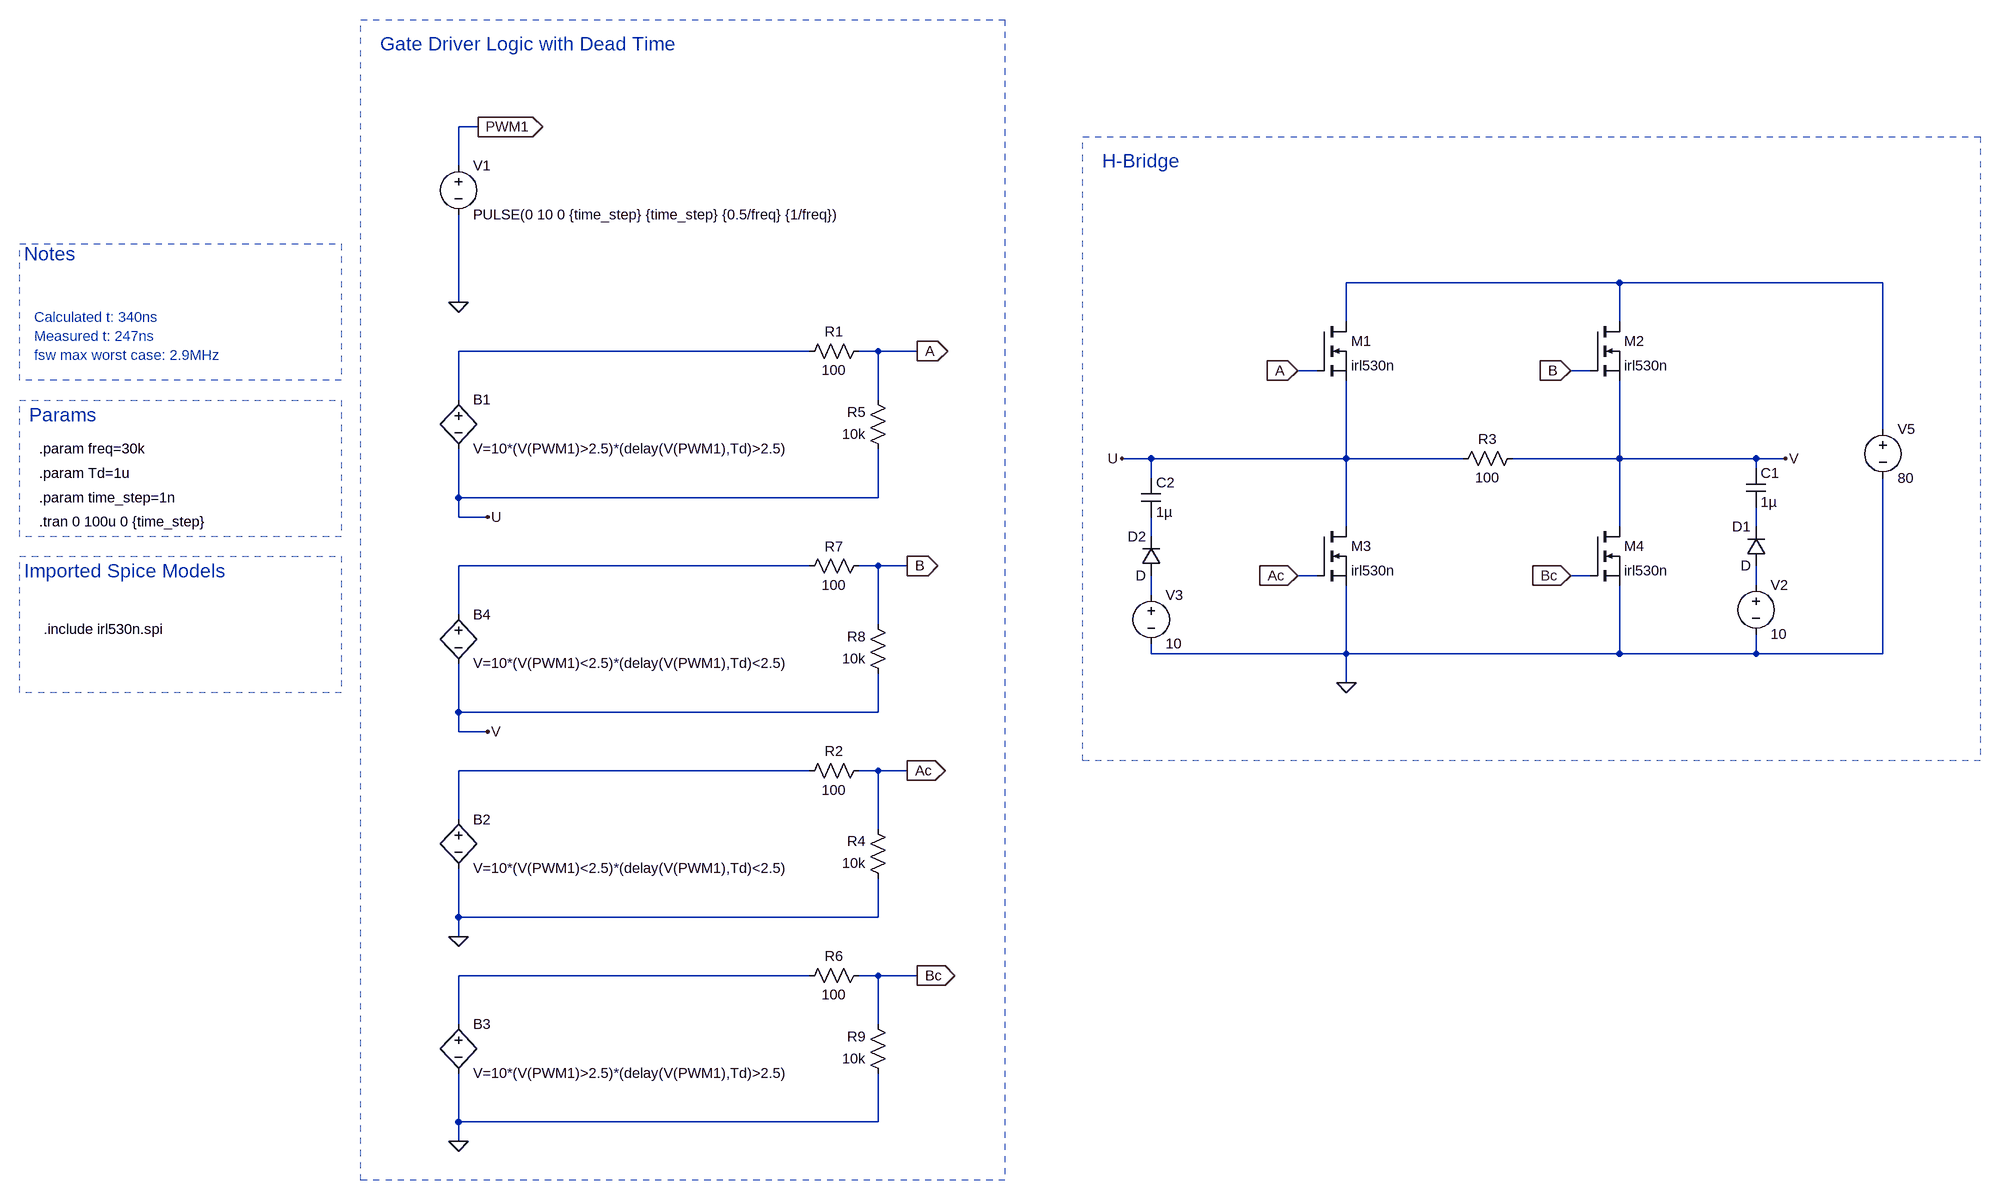
[diagram p0: schematic H_Bridge.asc]
H_Bridge.asc, the LTspice schematic file:
Version 4.1
SHEET 1 4488 1076
WIRE 448 -736 416 -736
WIRE 416 -672 416 -736
WIRE 2320 -480 1872 -480
WIRE 2752 -480 2320 -480
WIRE 416 -448 416 -592
WIRE 1872 -416 1872 -480
WIRE 2320 -416 2320 -480
WIRE 992 -368 416 -368
WIRE 1104 -368 1072 -368
WIRE 1168 -368 1104 -368
WIRE 1824 -336 1792 -336
WIRE 2272 -336 2240 -336
WIRE 416 -288 416 -368
WIRE 1104 -288 1104 -368
WIRE 2752 -240 2752 -480
WIRE 1552 -192 1504 -192
WIRE 1872 -192 1872 -320
WIRE 1872 -192 1552 -192
WIRE 2064 -192 1872 -192
WIRE 2320 -192 2320 -320
WIRE 2320 -192 2144 -192
WIRE 2544 -192 2320 -192
WIRE 2592 -192 2544 -192
WIRE 2544 -176 2544 -192
WIRE 1552 -160 1552 -192
WIRE 416 -128 416 -208
WIRE 1104 -128 1104 -208
WIRE 1104 -128 416 -128
WIRE 416 -96 416 -128
WIRE 464 -96 416 -96
WIRE 1872 -80 1872 -192
WIRE 2320 -80 2320 -192
WIRE 2544 -80 2544 -112
WIRE 1552 -64 1552 -96
WIRE 992 -16 416 -16
WIRE 1104 -16 1072 -16
WIRE 1152 -16 1104 -16
WIRE 1824 0 1792 0
WIRE 2272 0 2240 0
WIRE 2544 16 2544 -16
WIRE 1552 32 1552 0
WIRE 416 64 416 -16
WIRE 1104 80 1104 -16
WIRE 1552 128 1552 112
WIRE 1872 128 1872 16
WIRE 1872 128 1552 128
WIRE 2320 128 2320 16
WIRE 2320 128 1872 128
WIRE 2544 128 2544 96
WIRE 2544 128 2320 128
WIRE 2752 128 2752 -160
WIRE 2752 128 2544 128
WIRE 1872 176 1872 128
WIRE 416 224 416 144
WIRE 1104 224 1104 160
WIRE 1104 224 416 224
WIRE 416 256 416 224
WIRE 464 256 416 256
WIRE 992 320 416 320
WIRE 1104 320 1072 320
WIRE 1152 320 1104 320
WIRE 416 400 416 320
WIRE 1104 416 1104 320
WIRE 416 560 416 480
WIRE 1104 560 1104 496
WIRE 1104 560 416 560
WIRE 416 592 416 560
WIRE 992 656 416 656
WIRE 1104 656 1072 656
WIRE 1168 656 1104 656
WIRE 416 736 416 656
WIRE 1104 736 1104 656
WIRE 416 896 416 816
WIRE 1104 896 1104 816
WIRE 1104 896 416 896
WIRE 416 928 416 896
FLAG 1792 -336 A
IOPIN 1792 -336 In
FLAG 1872 176 0
FLAG 1792 0 Ac
IOPIN 1792 0 In
FLAG 2240 -336 B
IOPIN 2240 -336 In
FLAG 2240 0 Bc
IOPIN 2240 0 In
FLAG 416 -448 0
FLAG 448 -736 PWM1
IOPIN 448 -736 Out
FLAG 1168 -368 A
IOPIN 1168 -368 Out
FLAG 1152 320 Ac
IOPIN 1152 320 Out
FLAG 416 592 0
FLAG 1168 656 Bc
IOPIN 1168 656 Out
FLAG 1152 -16 B
IOPIN 1152 -16 Out
FLAG 416 928 0
FLAG 1504 -192 U
FLAG 2592 -192 V
FLAG 464 -96 U
FLAG 464 256 V
SYMBOL nmos 1824 -80 R0
SYMATTR InstName M3
SYMATTR Value irl530n
SYMATTR Prefix X
SYMBOL voltage 2752 -256 R0
WINDOW 123 0 0 Left 0
WINDOW 39 0 0 Left 0
SYMATTR InstName V5
SYMATTR Value 80
SYMBOL res 2160 -208 R90
WINDOW 0 0 56 VBottom 2
WINDOW 3 32 56 VTop 2
SYMATTR InstName R3
SYMATTR Value 100
SYMBOL nmos 2272 -80 R0
SYMATTR InstName M4
SYMATTR Value irl530n
SYMATTR Prefix X
SYMBOL nmos 1824 -416 R0
SYMATTR InstName M1
SYMATTR Value irl530n
SYMATTR Prefix X
SYMBOL nmos 2272 -416 R0
SYMATTR InstName M2
SYMATTR Value irl530n
SYMATTR Prefix X
SYMBOL voltage 416 -688 R0
WINDOW 123 0 0 Left 0
WINDOW 39 0 0 Left 0
SYMATTR InstName V1
SYMATTR Value PULSE(0 10 0 {time_step} {time_step} {0.5/freq} {1/freq})
SYMBOL bv 416 -304 R0
SYMATTR InstName B1
SYMATTR Value V=10*(V(PWM1)>2.5)*(delay(V(PWM1),Td)>2.5)
SYMBOL bv 416 384 R0
SYMATTR InstName B2
SYMATTR Value V=10*(V(PWM1)<2.5)*(delay(V(PWM1),Td)<2.5)
SYMBOL res 1088 -384 R90
WINDOW 0 0 56 VBottom 2
WINDOW 3 32 56 VTop 2
SYMATTR InstName R1
SYMATTR Value 100
SYMBOL res 1088 304 R90
WINDOW 0 0 56 VBottom 2
WINDOW 3 32 56 VTop 2
SYMATTR InstName R2
SYMATTR Value 100
SYMBOL res 1120 512 R180
WINDOW 0 36 76 Left 2
WINDOW 3 36 40 Left 2
SYMATTR InstName R4
SYMATTR Value 10k
SYMBOL res 1120 -192 R180
WINDOW 0 36 76 Left 2
WINDOW 3 36 40 Left 2
SYMATTR InstName R5
SYMATTR Value 10k
SYMBOL cap 2528 -176 R0
SYMATTR InstName C1
SYMATTR Value 1µ
SYMBOL voltage 2544 0 R0
WINDOW 123 0 0 Left 0
WINDOW 39 0 0 Left 0
SYMATTR InstName V2
SYMATTR Value 10
SYMBOL diode 2560 -16 R180
WINDOW 0 24 64 Left 2
WINDOW 3 24 0 Left 2
SYMATTR InstName D1
SYMBOL cap 1536 -160 R0
SYMATTR InstName C2
SYMATTR Value 1µ
SYMBOL voltage 1552 16 R0
WINDOW 123 0 0 Left 0
WINDOW 39 0 0 Left 0
SYMATTR InstName V3
SYMATTR Value 10
SYMBOL diode 1568 0 R180
WINDOW 0 24 64 Left 2
WINDOW 3 24 0 Left 2
SYMATTR InstName D2
SYMBOL bv 416 720 R0
SYMATTR InstName B3
SYMATTR Value V=10*(V(PWM1)>2.5)*(delay(V(PWM1),Td)>2.5)
SYMBOL bv 416 48 R0
SYMATTR InstName B4
SYMATTR Value V=10*(V(PWM1)<2.5)*(delay(V(PWM1),Td)<2.5)
SYMBOL res 1088 640 R90
WINDOW 0 0 56 VBottom 2
WINDOW 3 32 56 VTop 2
SYMATTR InstName R6
SYMATTR Value 100
SYMBOL res 1088 -32 R90
WINDOW 0 0 56 VBottom 2
WINDOW 3 32 56 VTop 2
SYMATTR InstName R7
SYMATTR Value 100
SYMBOL res 1120 176 R180
WINDOW 0 36 76 Left 2
WINDOW 3 36 40 Left 2
SYMATTR InstName R8
SYMATTR Value 10k
SYMBOL res 1120 832 R180
WINDOW 0 36 76 Left 2
WINDOW 3 36 40 Left 2
SYMATTR InstName R9
SYMATTR Value 10k
TEXT -264 88 Left 2 !.include irl530n.spi
TEXT -272 -88 Left 2 !.tran 0 100u 0 {time_step}
TEXT -272 -208 Left 2 !.param freq=30k
TEXT -272 -168 Left 2 !.param Td=1u
TEXT -272 -128 Left 2 !.param time_step=1n
TEXT -288 -264 Left 3 ;Params
TEXT -296 -528 Left 3 ;Notes
TEXT -280 -424 Left 2 ;Calculated t: 340ns\nMeasured t: 247ns\nfsw max worst case: 2.9MHz
TEXT -296 -8 Left 3 ;Imported Spice Models
TEXT 288 -872 Left 3 ;Gate Driver Logic with Dead Time
TEXT 1472 -680 Left 3 ;H-Bridge
RECTANGLE Normal 1312 992 256 -912 1
RECTANGLE Normal 2912 304 1440 -720 1
RECTANGLE Normal 224 -320 -304 -544 1
RECTANGLE Normal 224 -64 -304 -288 1
RECTANGLE Normal 224 192 -304 -32 1

The netlist it stands for:
* H_Bridge.asc
X§M3 U Ac 0 irl530n  ; pins D G S
V5 N001 0 80
R3 V U 100
X§M4 V Bc 0 irl530n  ; pins D G S
X§M1 N001 A U irl530n  ; pins D G S
X§M2 N001 B V irl530n  ; pins D G S
V1 PWM1 0 PULSE(0 10 0 {time_step} {time_step} {0.5/freq} {1/freq})
B1 N002 U V=10*(V(PWM1)>2.5)*(delay(V(PWM1),Td)>2.5)
B2 N008 0 V=10*(V(PWM1)<2.5)*(delay(V(PWM1),Td)<2.5)
R1 A N002 100
R2 Ac N008 100
R4 0 Ac 10k
R5 U A 10k
C1 V N003 1µ
V2 N006 0 10
D1 N006 N003 D
C2 U N004 1µ
V3 N007 0 10
D2 N007 N004 D
B3 N009 0 V=10*(V(PWM1)>2.5)*(delay(V(PWM1),Td)>2.5)
B4 N005 V V=10*(V(PWM1)<2.5)*(delay(V(PWM1),Td)<2.5)
R6 Bc N009 100
R7 B N005 100
R8 V B 10k
R9 0 Bc 10k
.model D D
.lib standard.dio
.include irl530n.spi
.tran 0 100u 0 {time_step}
.param freq=30k
.param Td=1u
.param time_step=1n
* Params
* Notes
* Calculated t: 340ns
* Measured t: 247ns
* fsw max worst case: 2.9MHz
* Imported Spice Models
* Gate Driver Logic with Dead Time
* H-Bridge
.backanno
.end